# EAGLE design Maduino Zero A9G GPS Tracker v3.3 (EAGLE 6.1)
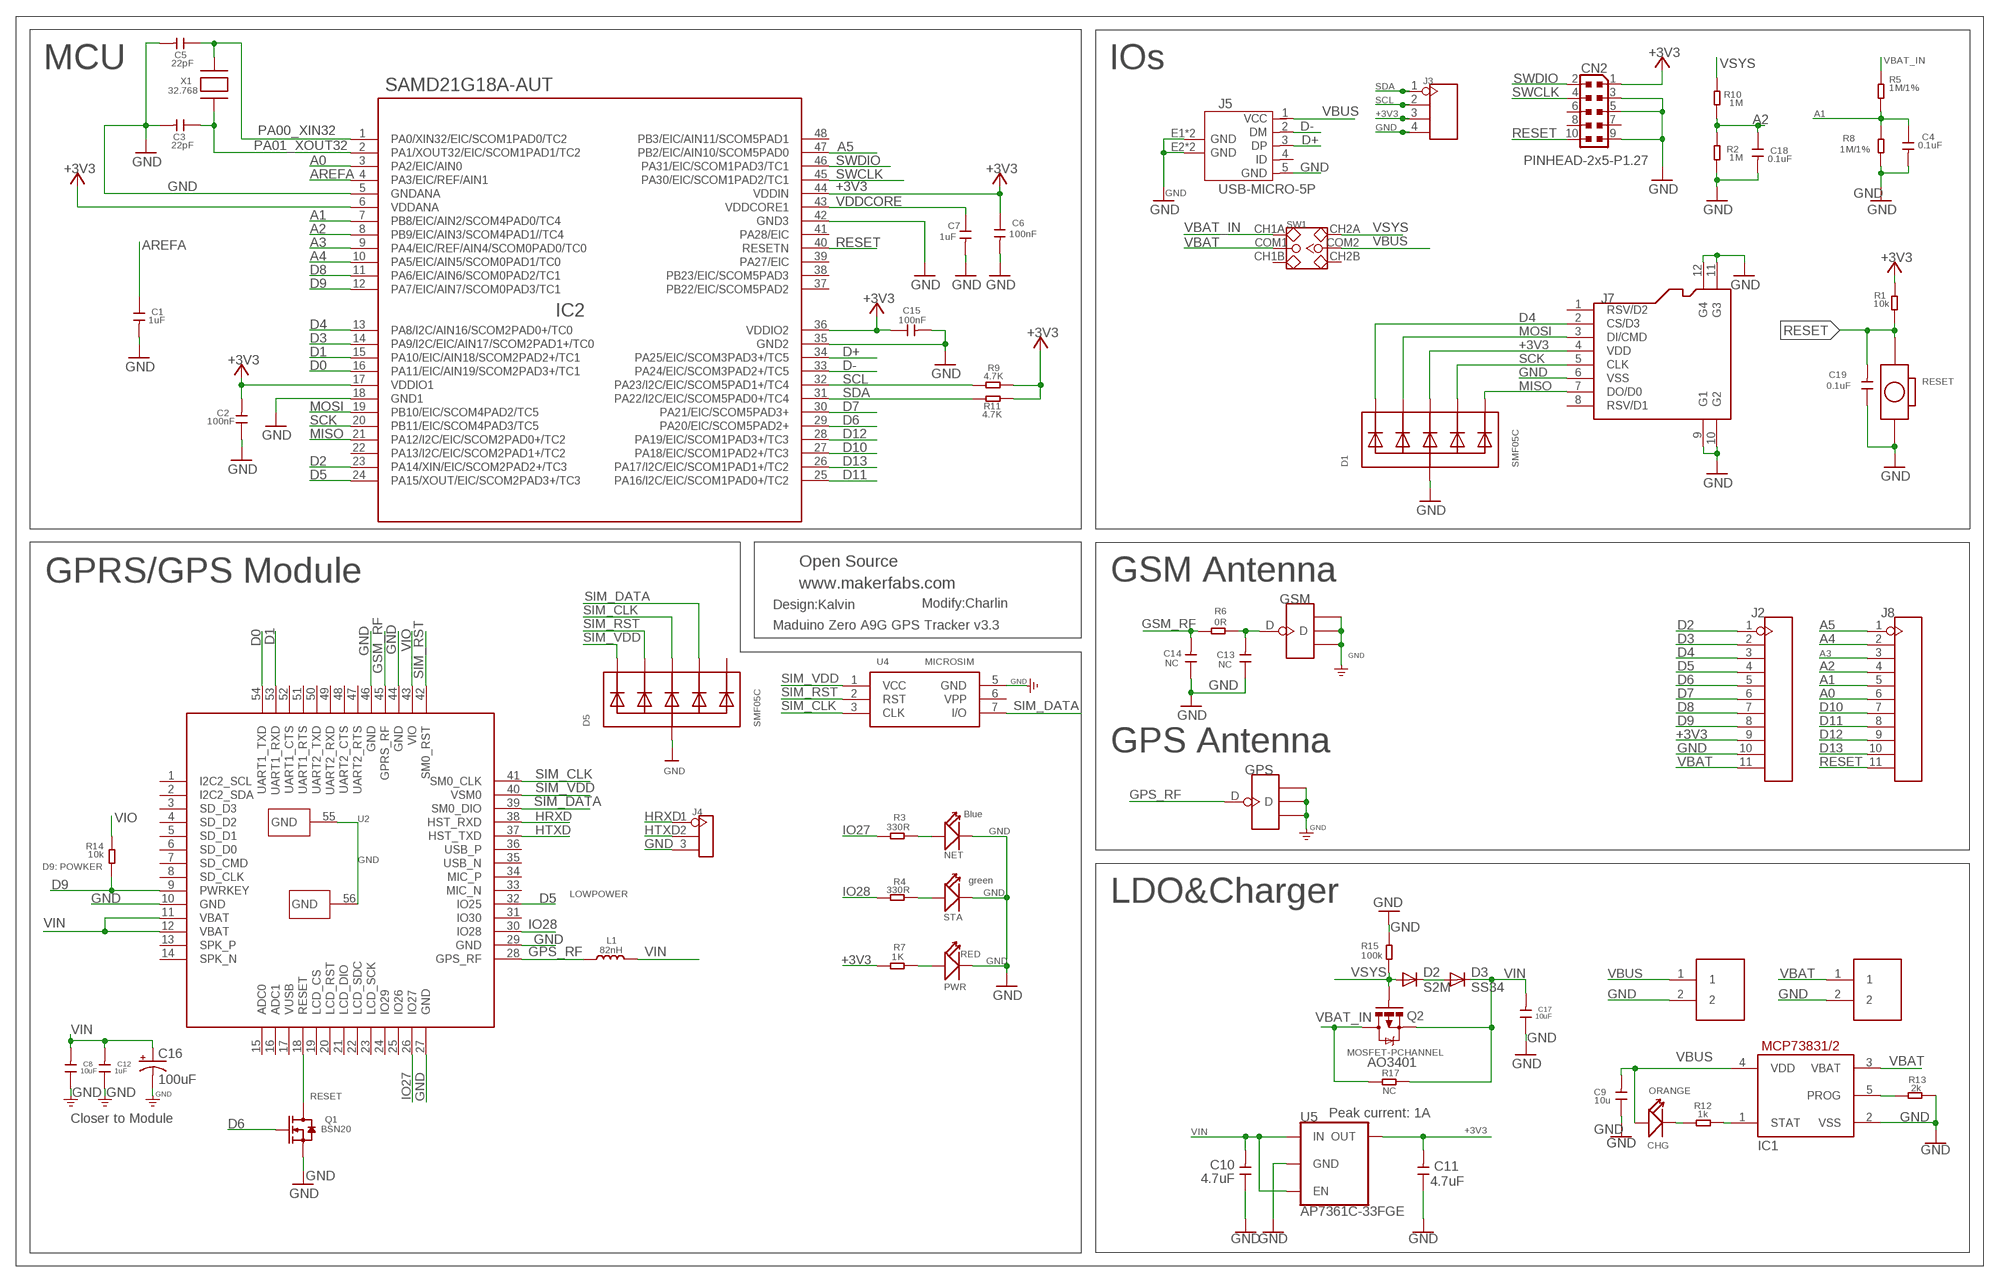
[diagram p0: schematic, sheet 1]

## Parts
C1  1uF  C-0603  [C0603]
C2  100nF  C-0603  [C0603]
C3  22pF  C-0603  [C0603]
C4  0.1uF  C-0603  [C0603]
C5  22pF  C-0603  [C0603]
C6  100nF  C-0603  [C0603]
C7  1uF  C-0603  [C0603]
C8  10uF  C-0603  [C0603]
C9  10u  C-0603  [C0603]
C10  4.7uF  C-0603  [C0603]
C11  4.7uF  C-0603  [C0603]
C12  1uF  C-0603  [C0603]
C13  NC  C-0402  [C0402]
C14  NC  C-0402  [C0402]
C15  100nF  C-0603  [C0603]
C16  100uF  68UF-POLAR-EIA3528-10V-10%(TANT)  [EIA3528]
C17  10uF  C-0603  [C0603]
C18  0.1uF  C-0603  [C0603]
C19  0.1uF  C-0603  [C0603]
CHG  ORANGE  007-LED0603  [D0603]
CN2  PINHEAD-2x5-P1.27  0171_PH127-205DF055G00AROUND-PADS  [PINHEAD_2X05_127]
D1  SMF05C  TVSARRAY_5LANE  [SOT363]
D2  S2M  DIODE-DO-214AC  [DO-214AC]
D3  SS34  DIODE-DO-214AC  [DO-214AC]
D5  SMF05C  TVSARRAY_5LANE  [SOT363]
GPS  ANTENNA-U-FL  [4P-U-FL]
GSM  ANTENNA-U-FL  [4P-U-FL]
IC1  MCP73831/OT  [SOT23-5L]
IC2  SAMD21G18A-AUT  ATSAMD21G18A-AUT  [TQFP48-7X7]
J1  PH2.0-2P-90-DIP  [PH2.0-2P-90-DIP]
J2  HEADER-11P-2.54  [11P-2.54]
J3  HEADER-4P-60/35MILROUND  [4P-65/35ROUND]
J4  HEADER-3P-2.54  [3P-2.54]
J5  USB-MICRO-5P  [MICRO-USB-5P]
J6  PH2.0-2P-90-DIP  [PH2.0-2P-90-DIP]
J7  HOLDER-MICROSD-8P  [8P-SMD]
J8  HEADER-11P-2.54  [11P-2.54]
L1  82nH  L'0603'  [L0603]
NET  Blue  LED'0603'  [LED-0603]
PWR  RED  LED'0603'  [LED-0603]
Q1  BSN20  MOSFET-N'SOT23'  [SOT23@1]
Q2  MOSFET-PCHANNEL  [SOT23-3]
R1  10k  R-0603  [R0603]
R2  1M  R-0603  [R0603]
R3  330R  R-0603  [R0603]
R4  330R  R-0603  [R0603]
R5  1M/1%  R-0603  [R0603]
R6  0R  R-0603  [R0603]
R7  1K  R-0603  [R0603]
R8  1M/1%  R-0603  [R0603]
R9  4.7K  R-0603  [R0603]
R10  1M  R-0603  [R0603]
R11  4.7K  R-0603  [R0603]
R12  1k  R-0603  [R0603]
R13  2k  R-0603  [R0603]
R14  10k  R-0603  [R0603]
R15  100k  R-0603  [R0603]
R17  NC  R-0603  [R0603]
RESET  BOTTON-2P-90D  [2P-7.62X3.56-90D]
STA  green  LED'0603'  [LED-0603]
SW1  SWITCH-2CH-6P  [6P-2CH-2.54-7.6X3.0]
U2  A9G  [A9G]
U4  MICROSIM  [MICROSIM]
U5  AP7361C-33FGE  [8-UDFN]
X1  32.768  XTAL-3.2X1.5  [XTAL3215]

## Nets
+3V3: C2.2 C6.1 C11.2 C15.1 CN2.1 D1.4(C3) IC2.6(VDDANA) IC2.17(VDDIO1) IC2.36(VDDIO2) IC2.44(VDDIN) J2.9 J3.3 J7.4(VDD) R1.2 R7.1 R9.2 R11.2 U5.1(OUT)
A0: IC2.3(PA2/EIC/AIN0) J8.6
A1: C4.1 IC2.7(PB8/EIC/AIN2/SCOM4PAD0/TC4) J8.5 R5.1 R8.2
A2: C18.1 IC2.8(PB9/EIC/AIN3/SCOM4PAD1//TC4) J8.4 R2.2 R10.1
A3: IC2.9(PA4/EIC/REF/AIN4/SCOM0PAD0/TC0) J8.3
A4: IC2.10(PA5/EIC/AIN5/SCOM0PAD1/TC0) J8.2
A5: IC2.47(PB2/EIC/AIN10/SCOM5PAD0) J8.1
AREFA: C1.1 IC2.4(PA3/EIC/REF/AIN1)
D0: IC2.16(PA11/EIC/AIN19/SCOM2PAD3+/TC1) U2.54(UART1_TXD)
D1: IC2.15(PA10/EIC/AIN18/SCOM2PAD2+/TC1) U2.53(UART1_RXD)
D2: IC2.23(PA14/XIN/EIC/SCOM2PAD2+/TC3) J2.1
D3: IC2.14(PA9/I2C/EIC/AIN17/SCOM2PAD1+/TC0) J2.2
D4: D1.1(C1) IC2.13(PA8/I2C/AIN16/SCOM2PAD0+/TC0) J2.3 J7.2(CS/D3)
D5: IC2.24(PA15/XOUT/EIC/SCOM2PAD3+/TC3) J2.4 U2.32(IO25)
D6: IC2.29(PA20/EIC/SCOM5PAD2+) J2.5 Q1.1(G)
D7: IC2.30(PA21/EIC/SCOM5PAD3+) J2.6
D8: IC2.11(PA6/EIC/AIN6/SCOM0PAD2/TC1) J2.7
D9: IC2.12(PA7/EIC/AIN7/SCOM0PAD3/TC1) J2.8 R14.1 U2.9(PWRKEY)
D10: IC2.27(PA18/EIC/SCOM1PAD2+/TC3) J8.7
D11: IC2.25(PA16/I2C/EIC/SCOM1PAD0+/TC2) J8.8
D12: IC2.28(PA19/EIC/SCOM1PAD3+/TC3) J8.9
D13: IC2.26(PA17/I2C/EIC/SCOM1PAD1+/TC2) J8.10
D+: IC2.34(PA25/EIC/SCOM3PAD3+/TC5) J5.3(DP)
D-: IC2.33(PA24/EIC/SCOM3PAD2+/TC5) J5.2(DM)
GND: C1.2 C2.1 C3.2 C4.2 C5.2 C6.2 C7.2 C8.1 C9.1 C10.1 C11.1 C12.1 C13.1 C14.1 C15.2 C16.C(-) C17.1 C18.2 C19.1 CN2.3 CN2.5 CN2.9 D1.2(A) D5.2(A) GPS.GND1 GPS.GND2 GPS.GND3 GSM.GND1 GSM.GND2 GSM.GND3 IC1.2(VSS) IC2.5(GNDANA) IC2.18(GND1) IC2.35(GND2) IC2.42(GND3) J1.2 J2.10 J3.4 J4.3 J5.5(GND) J5.E1(GND) J5.E2(GND) J5.P1(GND) J5.P2(GND) J6.2 J7.6(VSS) J7.9(G1) J7.10(G2) J7.11(G3) J7.12(G4) NET.- PWR.- Q1.2(S) R2.1 R8.1 R13.2 R15.2 RESET.P$2 STA.- U2.10(GND) U2.27(GND) U2.29(GND) U2.44(GND) U2.46(GND) U2.55(GND) U2.56(GND) U4.5(GND) U5.4(GND) U5.EP(GND)
GPS_RF: GPS.D L1.1 U2.28(GPS_RF)
GSM_RF: C14.2 R6.1 U2.45(GPRS_RF)
HRXD: J4.1 U2.38(HST_RXD)
HTXD: J4.2 U2.37(HST_TXD)
IO27: R3.1 U2.26(IO27)
IO28: R4.1 U2.30(IO28)
MISO: D1.6(C5) IC2.21(PA12/I2C/EIC/SCOM2PAD0+/TC2) J7.7(DO/D0)
MOSI: D1.3(C2) IC2.19(PB10/EIC/SCOM4PAD2/TC5) J7.3(DI/CMD)
N$1: R4.2 STA.+
N$2: D2.C D3.A
N$3: PWR.+ R7.2
N$7: NET.+ R3.2
N$8: Q1.3(D) U2.18(RESET)
N$25: CHG.- R12.1
N$26: IC1.1(STAT) R12.2
N$31: IC1.5(PROG) R13.1
N$94: C13.2 GSM.D R6.2
PA00_XIN32: C5.1 IC2.1(PA0/XIN32/EIC/SCOM1PAD0/TC2) X1.P$2
PA01_XOUT32: C3.1 IC2.2(PA1/XOUT32/EIC/SCOM1PAD1/TC2) X1.P$1
RESET: C19.2 CN2.10 IC2.40(RESETN) J8.11 R1.1 RESET.P$1
SCK: D1.5(C4) IC2.20(PB11/EIC/SCOM4PAD3/TC5) J7.5(CLK)
SCL: IC2.32(PA23/I2C/EIC/SCOM5PAD1+/TC4) J3.2 R9.1
SDA: IC2.31(PA22/I2C/EIC/SCOM5PAD0+/TC4) J3.1 R11.1
SIM_CLK: D5.4(C3) U2.41(SM0_CLK) U4.3(CLK)
SIM_DATA: D5.5(C4) U2.39(SM0_DIO) U4.7(I/O)
SIM_RST: D5.3(C2) U2.42(SM0_RST) U4.2(RST)
SIM_VDD: D5.1(C1) U2.40(VSM0) U4.1(VCC)
SWCLK: CN2.4 IC2.45(PA30/EIC/SCOM1PAD2/TC1)
SWDIO: CN2.2 IC2.46(PA31/EIC/SCOM1PAD3/TC1)
VBAT: IC1.3(VBAT) J2.11 J6.1 SW1.COM1
VBAT_IN: Q2.3(D) R5.2 R17.1 SW1.CH1A
VBUS: C9.2 CHG.+ IC1.4(VDD) J1.1 J5.1(VCC) SW1.COM2
VDDCORE: C7.1 IC2.43(VDDCORE1)
VIN: C8.2 C10.2 C12.2 C16.A(+) C17.2 D3.C L1.2 Q2.2(S) R17.2 U2.11(VBAT) U2.12(VBAT) U5.5(EN) U5.8(IN)
VIO: R14.2 U2.43(VIO)
VSYS: D2.A Q2.1(G) R10.2 R15.1 SW1.CH2A
Unconnected: CN2.6 CN2.7 CN2.8 D5.6(C5) IC2.22(PA13/I2C/EIC/SCOM2PAD1+/TC2) IC2.37(PB22/EIC/SCOM5PAD2) IC2.38(PB23/EIC/SCOM5PAD3) IC2.39(PA27/EIC) IC2.41(PA28/EIC) IC2.48(PB3/EIC/AIN11/SCOM5PAD1) J5.4(ID) J7.1(RSV/D2) J7.8(RSV/D1) SW1.CH1B SW1.CH2B U2.1(I2C2_SCL) U2.2(I2C2_SDA) U2.3(SD_D3) U2.4(SD_D2) U2.5(SD_D1) U2.6(SD_D0) U2.7(SD_CMD) U2.8(SD_CLK) U2.13(SPK_P) U2.14(SPK_N) U2.15(ADC0) U2.16(ADC1) U2.17(VUSB) U2.19(LCD_CS) U2.20(LCD_RST) U2.21(LCD_DIO) U2.22(LCD_SDC) U2.23(LCD_SCK) U2.24(IO29) U2.25(IO26) U2.31(IO30) U2.33(MIC_N) U2.34(MIC_P) U2.35(USB_N) U2.36(USB_P) U2.47(UART2_RTS) U2.48(UART2_CTS) U2.49(UART2_RXD) U2.50(UART2_TXD) U2.51(UART1_RTS) U2.52(UART1_CTS) U4.6(VPP)

## Notes on the sheet
- MCU | IOs
- Open Source
- GPRS/GPS Module | GSM Antenna
- www.makerfabs.com
- Design:Kalvin | Modify:Charlin
- Maduino Zero A9G GPS Tracker v3.3
- GPS Antenna
- D9: POWKER
- LOWPOWER
- LDO&Charger
- AO3401
- RESET
- Peak current: 1A
- Closer to Module

## Library data of the parts
C1-C15 C17-C19 = Discrete:C*: Ceramic Capacitors
C16 = SparkFun-Capacitors:68UF-POLAR: 68µF polarized capacitors A capacitor is a passive two-terminal electrical component used to store electrical energy temporarily in an electric field.; PROD_ID: CAP-10790; VALUE: 68uF
CHG = Discrete:007-LED*
CN2 = Connettori:0171_PH127-205DF055G00A: 2x5 PASSO 1,27
D1 D5 = microbuilder:TVSARRAY_5LANE: Voltage Transient Suppressor Array SOT363 SMF05C - 100W 5V: Digikey - SMF05CT1GOSCT-ND
D2 D3 = diode:DIODE-: DIODE
GPS GSM = Connector:ANTENNA-U-FL
IC1 = adafruit:MCP73831: MCP73831/2 Miniature Single-Cell, Fully Integrated Li-Ion, Li-Polymer Charge Management Controllers. Nice and small simple lipoly charge controller, with adjustable current and status output (LED) http://www.ladyada.net/library/pcb/eaglelibrary.html
IC2 = IC:ATSAMD21G18A-AUT: Atmel D21 32bit ARM Cortex-M0 microcontroller - 48 PIN TQFP 256KB flash memory + 32KB SRAM
J1 J6 = Connector:PH2.0-2P-90-DIP
J2 J8 = Connector:HEADER-11P
J3 = Connector:HEADER-4P
J4 = Connector:HEADER-3P
J5 = Connector:USB-MICRO-5P
J7 = Connector:HOLDER-MICROSD-8P
L1 = Discrete:L*
NET PWR STA = Discrete:LED*
Q1 = Discrete:MOSFET-N: IRLL014: http://www.vishay.com/docs/91319/sihll014.pdf
Q2 = User-Submitted:MOSFET-PCHANNEL: Generic PMOSFET IRLML2244 - TRANS-11153 (SOT-23 -20V -4.3A) (1.Gate 2.Source 3.Drain) FQP27P06 - COM-10349 <http://www.sparkfun.com/products/10349> (TO-220 -60V -27A) (1.Gate 2.Source 3.Drain); PROD_ID: TRANS-08285
R1-R15 R17 = Discrete:R*
RESET = Discrete:BOTTON-2P
SW1 = Discrete:SWITCH-2CH-6P
U2 = A9G:A9G
U4 = Connector:MICROSIM
U5 = ublox:AP7361C-33FGE: AP7361C 3.3V LDO Regulator; PROD_ID: VREG-14094
X1 = adafruit2:XTAL: Low cost SMT crystals, no capacitors included http://www.ladyada.net/library/eagle

## Net classes
0 default: width 0.203 mm, drill 0.305 mm, clearance 0.152 mm
2 gnd: width 0.305 mm, drill 0.559 mm, clearance 0.254 mm
3 usbvcc: width 0.508 mm, drill 0.61 mm, clearance 0.254 mm
4 USBpair: width 0.254 mm, drill 0.406 mm, clearance 0.406 mm

## Board
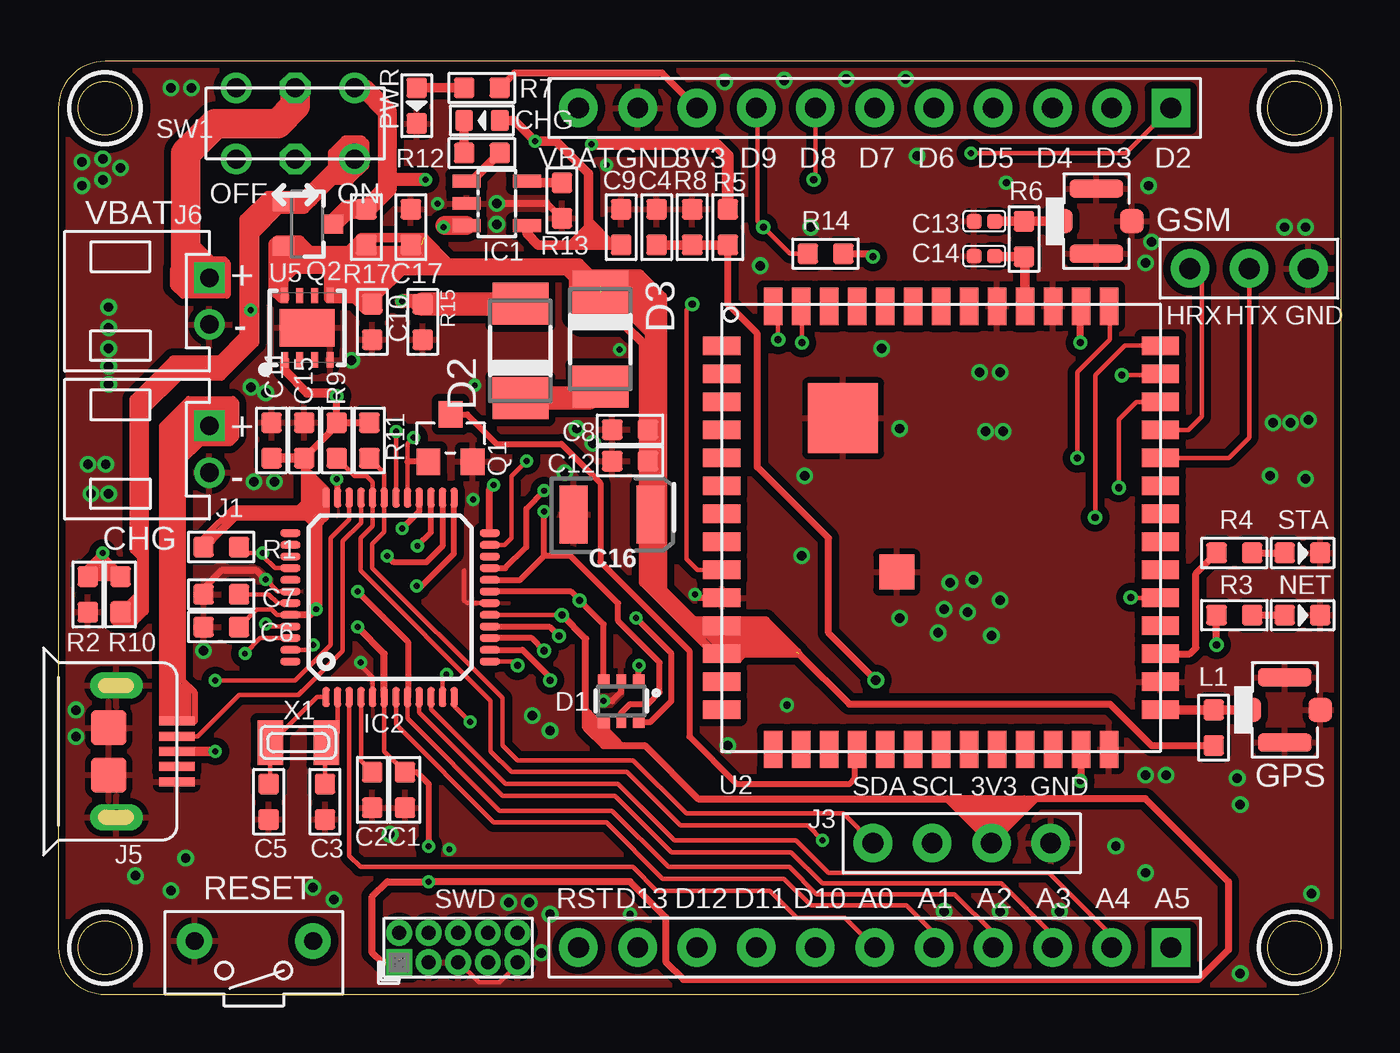
[diagram p1: board, top side]
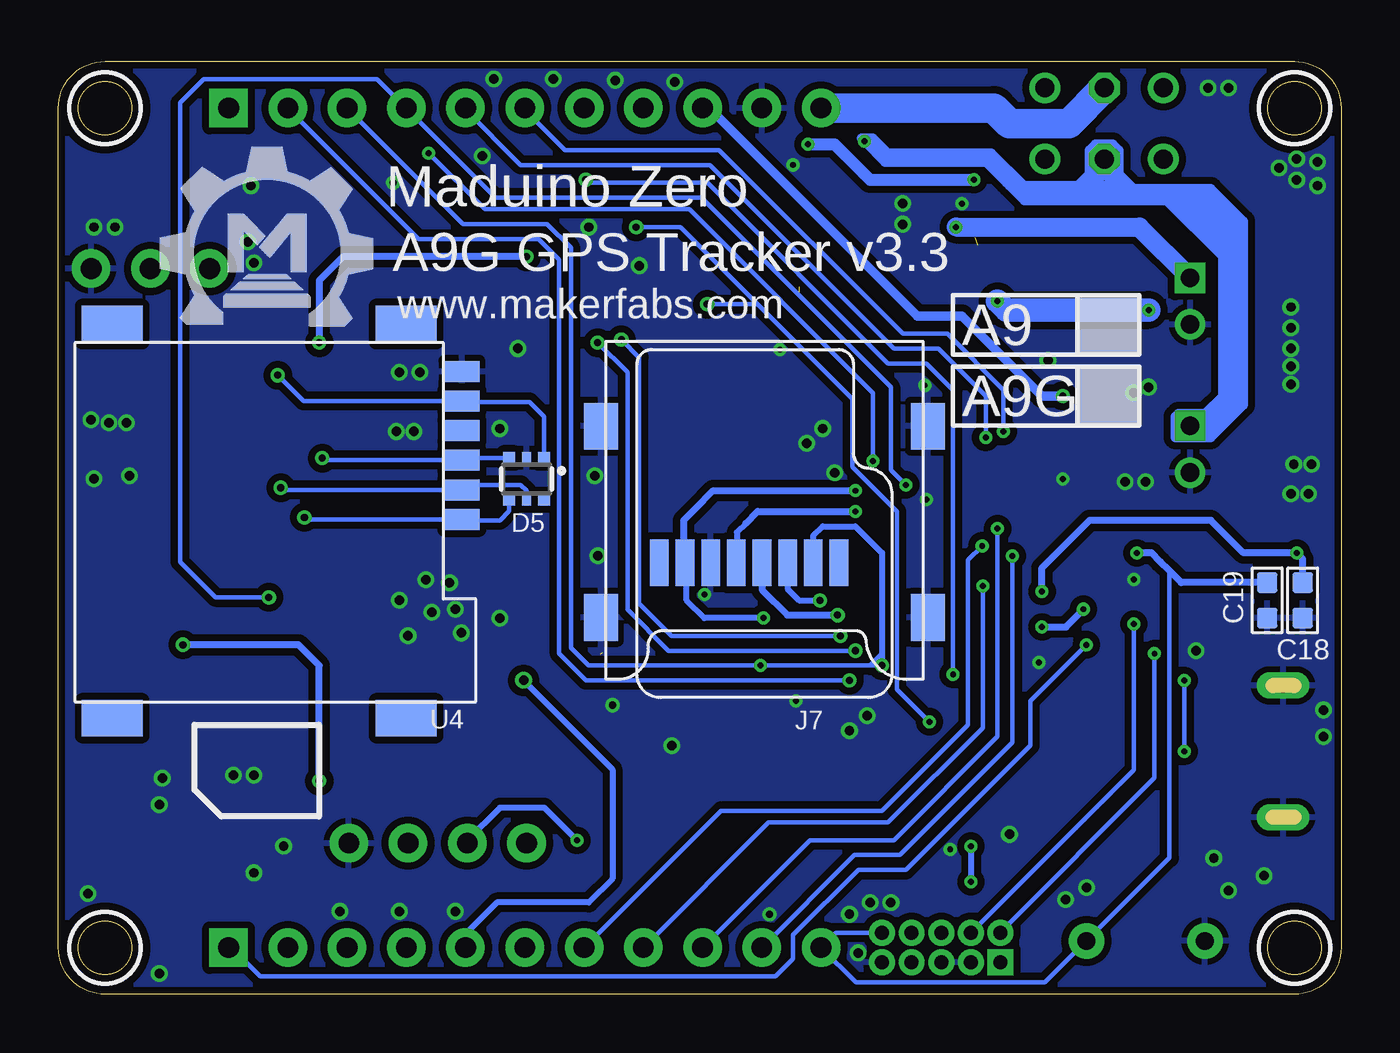
[diagram p2: board, bottom side, seen from below]

Size 55 x 40 mm. Coordinates in mm from the lower left corner, seen from the top.
Outline: 0,38 0,2 arc90 2,0 53,0 arc90 55,2 55,38 arc90 53,40 2,40 arc90 0,38
Outline: circle at 53,2 radius 1.14
Outline: circle at 53,38 radius 1.14
Outline: circle at 2,2 radius 1.14
Outline: circle at 2,38 radius 1.14
Copper layers (1*16): Top 0.035mm / dielectric 1.5mm / Bottom 0.035mm
Design rules: minimum track width 6mil, minimum drill 10mil, track to track 6mil, track to pad 6mil, pad to pad 6mil, via to via 6mil, smd to smd 0mil, copper to edge 10mil, drill to drill 10mil, minimum pad ring 10mil, minimum via ring 6mil, stop-mask expansion 2mil, vias tented up to drill 100mil, thermal gap 10mil
tRestrict: area 51.5,0.5 to 54.5,3.5; area 51.5,36.5 to 54.5,39.5; area 0.5,0.5 to 3.5,3.5; area 0.5,36.5 to 3.5,39.5
bRestrict: area 51.5,0.5 to 54.5,3.5; area 51.5,36.5 to 54.5,39.5; area 0.5,0.5 to 3.5,3.5; area 0.5,36.5 to 3.5,39.5

### Footprints (pad centres in the part's own frame; a part is rotated, then mirrored left to right if it is on the bottom)
C0603 = smd 0.889 x 0.889: 1 -0.762,0; 2 0.762,0
C0402 = smd 0.635 x 0.635: 1 -0.445,0; 2 0.445,0
EIA3528 = smd 1.2 x 2.5: A 1.65,0; C -1.65,0
D0603 = smd 0.762 x 0.889: + -0.762,0; - 0.762,0
PINHEAD_2X05_127 = drill 0.6 pad 1.016 square: 1 -0.635,2.54 | drill 0.6 pad 1.016: 2 0.635,2.54; 3 -0.635,1.27; 4 0.635,1.27; 5 -0.635,0; 6 0.635,0; 7 -0.635,-1.27; 8 0.635,-1.27; 9 -0.635,-2.54; 10 0.635,-2.54
SOT363 = smd 0.5 x 0.5: 1 -0.75,-0.9; 3 0.75,-0.9; 4 0.75,0.9; 6 -0.75,0.9 | smd 0.4 x 0.5: 2 0,-0.9; 5 0,0.9
DO-214AC = smd 1.8 x 2.4: A 2.025,0; C -2.025,0
4P-U-FL = smd 1.016 x 1.016: D -1.524,0; GND3 1.524,0 | smd 2.286 x 0.762: GND1 0,1.397; GND2 0,-1.397
SOT23-5L = smd 0.55 x 1.2: 1 -0.95,-1.3; 2 0,-1.3; 3 0.95,-1.3; 4 0.95,1.3; 5 -0.95,1.3
TQFP48-7X7 = smd 0.85 x 0.32: 1 -4.275,2.75; 2 -4.275,2.25; 3 -4.275,1.75; 4 -4.275,1.25; 5 -4.275,0.75; 6 -4.275,0.25; 7 -4.275,-0.25; 8 -4.275,-0.75; 9 -4.275,-1.25; 10 -4.275,-1.75; 11 -4.275,-2.25; 12 -4.275,-2.75; 25 4.275,-2.75; 26 4.275,-2.25; 27 4.275,-1.75; 28 4.275,-1.25; 29 4.275,-0.75; 30 4.275,-0.25; 31 4.275,0.25; 32 4.275,0.75; 33 4.275,1.25; 34 4.275,1.75; 35 4.275,2.25; 36 4.275,2.75 | smd 0.32 x 0.85: 13 -2.75,-4.275; 14 -2.25,-4.275; 15 -1.75,-4.275; 16 -1.25,-4.275; 17 -0.75,-4.275; 18 -0.25,-4.275; 19 0.25,-4.275; 20 0.75,-4.275; 21 1.25,-4.275; 22 1.75,-4.275; 23 2.25,-4.275; 24 2.75,-4.275; 37 2.75,4.275; 38 2.25,4.275; 39 1.75,4.275; 40 1.25,4.275; 41 0.75,4.275; 42 0.25,4.275; 43 -0.25,4.275; 44 -0.75,4.275; 45 -1.25,4.275; 46 -1.75,4.275; 47 -2.25,4.275; 48 -2.75,4.275
PH2.0-2P-90-DIP = drill 0.8 square: 1 0,1 | drill 0.8: 2 0,-1
11P-2.54 = drill 0.889 pad 1.651 square: 1 0,12.7 | drill 0.889 pad 1.651: 2 0,10.16; 3 0,7.62; 4 0,5.08; 5 0,2.54; 6 0,0; 7 0,-2.54; 8 0,-5.08; 9 0,-7.62; 10 0,-10.16; 11 0,-12.7
4P-65/35ROUND = drill 0.889 pad 1.651: 1 0,3.81; 2 0,1.27; 3 0,-1.27; 4 0,-3.81
3P-2.54 = drill 0.9 pad 1.651: 1 0,2.54; 2 0,0; 3 0,-2.54
MICRO-USB-5P = smd 0.38 x 1.52: 1 -1.3,0; 2 -0.65,0; 3 0,0; 4 0.65,0; 5 1.3,0 | smd 1.524 x 1.524: E1 -1.016,-2.921; E2 1.016,-2.921 | drill 0.635 pad 1.143 long: P1 -2.819,-2.591; P2 2.819,-2.591
8P-SMD = smd 0.8 x 2.008: 1 -3.198,0.254; 2 -2.098,0.254; 3 -0.998,0.254; 4 0.102,0.254; 5 1.202,0.254; 6 2.302,0.254; 7 3.402,0.254; 8 4.502,0.254 | smd 1.45 x 2: 9 -7.002,2.6; 10 7.002,2.6; 11 -7.002,-5.598; 12 7.002,-5.598
L0603 = smd 0.889 x 0.889: 1 -0.762,0; 2 0.762,0
LED-0603 = smd 0.889 x 0.889: + -0.762,0; - 0.762,0
SOT23@1 = smd 1.016 x 1.143: 1 -0.95,-1.016; 2 0.95,-1.016; 3 0,1.016
SOT23-3 = smd 0.8 x 0.9: 1 -0.95,-1; 2 0.95,-1; 3 0,1.1
R0603 = smd 0.889 x 0.889: 1 -0.762,0; 2 0.762,0
2P-7.62X3.56-90D = drill 0.762 pad 1.524: P$1 0,2.54; P$2 0,-2.54
6P-2CH-2.54-7.6X3.0 = drill 0.813 pad 1.27: CH1A -1.524,2.54; CH1B -1.524,-2.54; CH2A 1.524,2.54; CH2B 1.524,-2.54 | drill 0.813 pad 1.27 octagon: COM1 -1.524,0; COM2 1.524,0
A9G = smd 1.6 x 0.8: 1 -9.4,7.8; 2 -9.4,6.6; 3 -9.4,5.4; 4 -9.4,4.2; 5 -9.4,3; 6 -9.4,1.8; 7 -9.4,0.6; 8 -9.4,-0.6; 9 -9.4,-1.8; 10 -9.4,-3; 11 -9.4,-4.2; 12 -9.4,-5.4; 13 -9.4,-6.6; 14 -9.4,-7.8; 28 9.4,-7.8; 29 9.4,-6.6; 30 9.4,-5.4; 31 9.4,-4.2; 32 9.4,-3; 33 9.4,-1.8; 34 9.4,-0.6; 35 9.4,0.6; 36 9.4,1.8; 37 9.4,3; 38 9.4,4.2; 39 9.4,5.4; 40 9.4,6.6; 41 9.4,7.8 | smd 0.8 x 1.6: 15 -7.2,-9.5; 16 -6,-9.5; 17 -4.8,-9.5; 18 -3.6,-9.5; 19 -2.4,-9.5; 20 -1.2,-9.5; 21 0,-9.5; 22 1.2,-9.5; 23 2.4,-9.5; 24 3.6,-9.5; 25 4.8,-9.5; 26 6,-9.5; 27 7.2,-9.5; 42 7.2,9.5; 43 6,9.5; 44 4.8,9.5; 45 3.6,9.5; 46 2.4,9.5; 47 1.2,9.5; 48 0,9.5; 49 -1.2,9.5; 50 -2.4,9.5; 51 -3.6,9.5; 52 -4.8,9.5; 53 -6,9.5; 54 -7.2,9.5 | smd 3 x 3: 55 -4.2,4.7 | smd 1.5 x 1.5: 56 -1.9,-1.9
MICROSIM = smd 1.5 x 0.9: 1 -0.8,2.5; 2 -0.8,5.04; 3 -0.8,7.58; 5 -0.8,1.23; 6 -0.8,3.77; 7 -0.8,6.31 | smd 2.61 x 1.56: P$1 1.6,-0.8; P$2 14.2,-0.8; P$3 14.2,16.1; P$4 1.6,16.1
8-UDFN = smd 0.3 x 0.65: 1 -0.975,-1.375; 2 -0.325,-1.375; 3 0.325,-1.375; 4 0.975,-1.375; 5 0.975,1.375; 6 0.325,1.375; 7 -0.325,1.375; 8 -0.975,1.375 | smd 2.35 x 1.6: EP 0,0
XTAL3215 = smd 1.1 x 1.9: P$1 1.2,0; P$2 -1.2,0

### Placement (x,y rotation side)
C1  13.46,8.76 270 top
C2  14.86,8.76 90 top
C3  11.43,8.26 270 top
C4  25.65,32.89 90 top
C5  9.02,8.26 270 top
C6  6.99,15.75 180 top
C7  6.99,17.14 180 top
C8  24.51,24.21 0 top
C9  24.13,32.89 270 top
C10  13.46,28.83 90 top
C11  9.14,23.75 270 top
C12  24.51,22.86 0 top
C13  39.7,33.15 0 top
C14  39.7,31.65 0 top
C15  10.54,23.75 90 top
C16  23.75,20.57 0 top
C17  15.11,32.89 270 top
C18  1.65,16.89 270 bottom
C19  3.17,16.89 90 bottom
CHG  18.16,37.47 180 top
CN2  17.14,2 90 top
D1  24.13,12.57 180 top
D2  19.81,27.58 90 top
D3  23.24,28.09 270 top
D5  34.92,22.1 180 bottom
GPS  52.58,12.19 0 top
GSM  44.5,33.15 0 top
IC1  18.8,33.91 270 top
IC2  14.22,17.02 90 top
J1  6.48,23.37 0 top
J2  35,38 270 top
J3  38.73,6.48 90 top
J4  51.05,31.11 90 top
J5  5.08,10.41 270 top
J6  6.48,29.72 0 top
J7  24.73,18.76 180 bottom
J8  35,2 270 top
L1  49.53,11.43 270 top
NET  53.34,16.26 0 top
PWR  15.37,38.1 270 top
Q1  16.81,23.85 0 top
Q2  10.67,33.02 270 top
R1  6.99,19.18 180 top
R2  1.27,17.14 90 top
R3  50.42,16.26 0 top
R4  50.42,18.92 0 top
R5  28.7,32.89 90 top
R6  41.4,32.38 90 top
R7  18.16,38.86 180 top
R8  27.18,32.89 270 top
R9  11.94,23.75 90 top
R10  2.67,17.14 270 top
R11  13.34,23.75 90 top
R12  18.16,36.07 0 top
R13  21.59,34.04 270 top
R14  32.89,31.75 0 top
R15  15.62,28.83 270 top
R17  13.21,32.89 270 top
RESET  8.38,2.29 270 top
STA  53.34,18.92 0 top
SW1  10.16,37.34 270 top
U2  37.85,20 0 top
U4  38.49,27.94 180 bottom
U5  10.67,28.57 0 top
U$1  [MAKERFABS_0.3]  50.17,28.7 0 bottom
X1  10.29,10.79 0 top

### Tracks (layer width: path | path; a pad name or v marks a point on that pad's centre or on a via)
+3V3  (via drill 0.25, 0.3)
  Top 0.203: IC2.6 13.97,10.41 C2.2 | IC2.44 9.39,16.27 9.14,16.51 8.51,16.51 C6.1 | v21.59,16.26 18.51,16.26 IC2.17
  Top 0.254: C15.1 10.54,23.11 | v15.88,6.35 15.88,9.02 15.37,9.53 C2.2 | 11.43,21.72 11.43,21.08 10.92,20.57 11.18,20.57 11.43,20.83 11.43,20.57 | 11.43,21.72 10.67,22.48 10.67,21.21 10.29,20.83 7.49,20.83 6.35,19.68 6.6,19.43 7.62,20.45 10.79,20.45 | 11.43,20.57 11.35,20.5 11.2,20.5 10.72,20.98 10.72,22.05 10.82,22.15 10.82,22.07 11.3,21.59 11.3,21.26 10.97,20.93 10.97,21.72 10.87,21.82 10.9,21.82 11.12,21.59 11.12,21.31 | 11.51,21.31 11.51,20.65 11.43,20.57 | 11.43,21.72 11.51,21.64 11.51,20.68 11.35,20.52 | 6.66,19.89 6.55,19.89 6.12,19.46 6.12,19.28 R1.2 | 22.76,12.06 23.9,10.92 | 24.16,10.67 23.9,10.92 | 23.9,10.92 23.62,10.92
  Top 0.305: CN2.1 13.88,1.36 13.46,1.78 13.46,4.19 14.1,4.83 v15.88,4.83 24.51,4.83 26.04,3.3 26.04,1.4 26.8,0.64 48.9,0.64 50.16,1.91 50.16,4.83 46.61,8.38 41.91,8.38 | R9.2 v11.94,25.65 | R9.2 R11.2 13.46,24.51 | R9.2 11.94,24.38 C15.1 10.54,20.83 10.67,20.7 | J2.9 25.88,39.5 19.56,39.5 R7.1 | 22.67,11.37 22.61,11.43 22.61,12.19 | 22.67,11.37 23.37,10.67 24.16,10.67 25.15,10.67 27.43,8.38 38.1,8.38 | 22.61,12.19 22.61,15.24 v21.59,16.26 | IC2.6 13.97,14.6 v12.83,15.75 | v11.05,16.51 10.79,16.26 9.91,16.26 9.92,16.27 IC2.44 | IC2.36 11.47,21.13 11.43,21.08 11.05,20.7 | 11.05,20.7 11.05,20.19 | 10.67,20.7 11.05,20.7 | R1.2 7.75,20.7 10.67,20.7 | 22.67,11.37 22.73,11.43 23.14,11.43 D1.4 | 38.1,8.38 38.35,8.38 | 40.01,8.38 41.4,8.38 | 41.4,8.38 41.91,8.38 | J3.3 40.01,8.38 | 40.01,8.38 38.35,8.38 | 38.35,8.38 38.35,8.13 | 38.35,8.13 J3.3 | J3.3 41.4,7.87 | 41.4,7.87 41.4,8.26 | 41.4,8.38 41.4,8.26 | 41.4,8.26 40.13,6.99 40.01,6.99 39.88,6.86 39.88,6.99 38.61,8.26 41.02,8.26 41.15,8.13 40.89,8.13 40.13,7.37 39.75,7.37 39.75,7.49 39.12,8.13 40.51,8.13 40.64,8 40.51,8 40.39,7.87 | 40.39,7.87 40.13,7.62 39.88,7.62 39.5,8 40.26,8 40.39,7.87 | 41.91,8.38 41.4,7.87 | 38.1,8.38 38.35,8.13 | 22.61,12.19 22.99,11.81 23.5,11.81 23.5,10.79 22.73,11.56 22.73,11.81 23.11,11.43 | 23.37,11.18 23.11,11.43 | 23.11,11.43 23.11,11.68
  Top 0.406: C11.2 C15.1 | U5.1 9.69,26.76 10.67,25.78 11.81,25.78 v11.94,25.65
  Top 0.508: 11.05,20.19 v11.05,16.51 | 10.79,20.45 11.05,20.19 | 11.05,20.19 11.35,20.5
  Bottom 0.254: 24.89,18.44 J7.4 | v15.88,6.35 v15.88,4.83
  Bottom 0.305: J7.4 24.83,17.34 23.75,16.26 v21.59,16.26 | v12.83,15.75 11.8,15.75 v11.05,16.5 v11.05,16.51
  Bottom 0.406: J2.9 27.08,38 18.16,29.08 16.26,29.08 12.83,25.65 v11.94,25.65
A0
  Top 0.203: IC2.3 12.47,5.94 12.95,5.46 24.64,5.46 25.65,4.45 30.5,4.45 31.67,3.28 33.72,3.28 J8.6
A1  (via drill 0.41)
  Top 0.203: IC2.7 14.47,11.56 18.67,7.37 23.5,7.37 25.91,4.95 31.11,4.95 32.26,3.81 36.24,3.81 36.37,3.81 37.54,2.63 J8.5
  Top 0.305: v35.05,13.46 33.02,15.49 33.02,19.56 29.97,22.61 29.97,28.32 28.7,29.59 R5.1
  Top 0.406: C4.1 R8.2 R5.1
  Bottom 0.254: v35.05,13.46 31.24,9.65 31.24,4.95 32.26,3.94 36.2,3.94 37.54,2.59 J8.5
A2  (via drill 0.25)
  Top 0.203: IC2.8 14.97,11.82 18.92,7.87 23.75,7.87 26.16,5.46 31.34,5.46 32.51,4.29 38.42,4.29 40.08,2.63 J8.4
  Top 0.254: 14.99,12.76 14.99,15.11 v12.83,17.27
  Top 0.305: 1.91,17.91 1.91,18.41 | 14.99,12.76 IC2.8 | 1.91,18.8 1.91,18.67 | 1.91,18.67 1.91,18.41 | 1.91,18.41 2.29,18.03 1.91,18.03 1.78,18.16 1.4,18.16 | 1.52,18.29 1.91,18.67 | 1.91,18.8 v1.91,18.92 1.27,18.29 1.27,18.16 | 1.91,18.8 2.41,18.29 1.52,18.29 | 1.52,18.29 1.4,18.16 | 1.4,18.16 1.27,18.16 | 1.27,18.16 1.91,18.8
  Top 0.406: R2.2 1.91,17.91 R10.1
  Bottom 0.305: C18.1 1.65,18.67 v1.91,18.92 4.19,18.92 5.59,20.32 10.79,20.32 12.83,18.29 v12.83,17.27
A3
  Top 0.203: IC2.9 15.47,12.09 19.05,8.51 23.88,8.51 26.29,6.1 31.42,6.1 32.77,4.75 40.43,4.75 42.62,2.56 J8.3
A4
  Top 0.203: IC2.10 15.97,12.22 19.18,9.02 24,9.02 26.42,6.6 31.62,6.6 33.02,5.21 42.46,5.21 45.16,2.51 J8.2
A5  (via drill 0.25)
  Top 0.203: IC2.47 10.7,14.77 v10.92,14.99
  Bottom 0.203: J8.1 47.59,2 46.35,0.76 24.26,0.76 23.5,1.52 23.5,2.54 20.7,5.33 18.67,5.33 13.34,10.67 13.34,12.57 v10.92,14.99
AREFA
  Top 0.203: IC2.4 12.97,10.01 C1.1
D0  (via drill 0.3)
  Top 0.203: 30.73,29.41 U2.54 30.86,29.29 v30.86,28.07
  Top 0.254: v21.46,15.37 21.08,15.75 18.48,15.75 | 18.41,15.75 18.48,15.75 | 18.48,15.75 IC2.16
  Bottom 0.203: v21.46,15.37 28.7,15.37 30.1,16.76 30.1,27.3 v30.86,28.07
D1  (via drill 0.3)
  Top 0.203: v31.88,27.94 31.88,29.47 U2.53
  Top 0.254: v20.83,14.73 20.29,15.27 IC2.15
  Bottom 0.203: v31.88,27.94 30.61,26.67 30.61,16.51 28.83,14.73 v20.83,14.73
D2  (via drill 0.25)
  Top 0.203: IC2.23 19.14,19.27 19.43,19.56 19.43,22.23 v20.07,22.86 | v39.12,36.07 45.77,36.07 J2.1
  Bottom 0.203: v39.12,36.07 36.7,33.66 27.94,33.66 20.07,25.78 v20.07,22.86
D3  (via drill 0.3)
  Top 0.254: v21.08,13.46 21.08,13.59 19.9,14.77 IC2.14
  Bottom 0.203: v21.08,13.46 32.38,13.46 33.53,14.61 33.53,31.5 34.42,32.38 39.55,32.38 J2.2
D4  (via drill 0.25, 0.3)
  Top 0.203: IC2.13 19.51,14.27 v19.68,14.1
  Top 0.254: D1.1 v24.88,14.11 v24.89,14.1
  Bottom 0.203: v19.68,14.1 20.19,14.1 | 20.19,14.1 v24.89,14.1 32.26,14.1 33.02,14.86 33.02,32 34.04,33.02 37.64,33.02 J2.3 | 20.19,14.1 19.94,14.35 | 19.68,14.61 19.94,14.35 | 19.94,14.35 19.94,14.22 19.81,14.22
  Bottom 0.254: J7.2 22.63,19.66 22.23,20.07 20.83,20.07 19.68,18.92 19.68,14.61 v19.68,14.1
D5  (via drill 0.25, 0.3)
  Top 0.203: U2.32 45.99,17 v45.97,17.02
  Top 0.305: IC2.24 18.5,21.67 v18.67,21.84
  Bottom 0.203: v45.97,17.02 48.26,17.02 49.78,18.54 49.78,38.23 48.77,39.24 41.32,39.24 J2.4 36.24,34.16 27.43,34.16 19.3,26.04 19.3,22.48 v18.67,21.84
D6  (via drill 0.25)
  Top 0.203: IC2.29 14.97,22.84 14.97,23.61 v15.24,23.88
  Top 0.254: Q1.1 14.97,22.84
  Bottom 0.203: v15.24,23.88 15.24,25.65 17.27,27.69 19.18,27.69 27.05,35.56 35.18,35.56 37.59,37.97 37.59,38 J2.5
D7  (via drill 0.25)
  Top 0.203: IC2.30 v14.47,24.13 v14.48,24.13
  Bottom 0.203: v14.48,24.13 14.48,25.91 16.89,28.32 18.8,28.32 26.67,36.2 33.27,36.2 35.05,37.97 35,37.97 J2.6
D8  (via drill 0.25, 0.3)
  Top 0.203: IC2.11 16.47,13.55 v16.64,13.72 | J2.7 32.46,35 v32.38,34.92
  Bottom 0.203: v16.64,13.72 16.64,25.91 17.78,27.05 19.43,27.05 27.18,34.8 32.26,34.8 v32.38,34.92
D9  (via drill 0.25, 0.3)
  Top 0.203: IC2.12 16.97,12.36 v17.65,11.68 | J2.8 29.97,37.95 29.97,33.15 v30.23,32.89 31.37,31.75 R14.1 | U2.9 27.39,18.2 26.92,18.67 26.92,27.94 26.92,29.34 v27.18,29.59
  Bottom 0.203: v17.65,11.68 19.05,13.08 19.05,20.7 20.95,22.61 20.95,25.53 24.89,29.46 | 24.89,29.46 28.32,32.89 v30.23,32.89 | v27.18,29.59 25.02,29.59 24.89,29.46
D10  (via drill 0.25)
  Top 0.254: v15.39,19.23 15.97,19.81 IC2.27
  Bottom 0.203: J8.7 26.59,7.87 19.68,7.87 16,11.56 16,18.62 v15.39,19.23
D11  (via drill 0.25)
  Top 0.254: v15.37,17.5 15.57,17.5 16.97,18.9 IC2.25
  Bottom 0.203: J8.8 24.55,7.37 19.43,7.37 15.37,11.43 v15.37,17.5
D12  (via drill 0.25)
  Top 0.254: IC2.28 15.47,20.71 v14.73,19.96
  Bottom 0.203: J8.9 22.78,6.6 19.18,6.6 14.73,11.05 v14.73,19.96
D13  (via drill 0.25)
  Top 0.254: IC2.26 16.47,19.22 15.77,18.52 14.38,18.52 v14.1,18.8
  Bottom 0.203: J8.10 20.87,5.97 18.92,5.97 14.1,10.79 v14.1,18.8
D+  (via drill 0.25)
  Top 0.203: IC2.34 12.47,20.35 11.68,19.56 11.68,14.99 10.16,13.46 v6.73,13.46
  Top 0.406: v6.73,10.41 J5.3
  Bottom 0.203: v6.73,13.46 v6.73,10.41
D-
  Top 0.203: IC2.33 12.97,20.21 12.19,19.43 12.19,14.73 10.67,13.21 | 10.67,13.21 10.3,12.84 | J5.2 5.98,11.06 7.75,12.83 10.29,12.83 10.67,13.21
GND  (via drill 0.25, 0.3, 0.41)
  Top 0.203: IC2.5 13.47,13.58 12.83,14.22 | IC2.18 17.52,16.77 17.4,16.89 17.4,18.16 | 19.75,1.33 19.81,1.4 | CN2.9 19.72,1.36 19.75,1.33 | IC2.42 9.4,17.27 | 19.75,1.33 18.92,0.51 18.03,0.51 17.14,1.4 | IC2.42 9.4,17.27 | 9.4,17.27 v8.89,17.78
  Top 0.254: D1.2 24.13,12.95 23.75,12.57 v23.37,12.57 | U2.10 27.45,17 v27.3,17.14 | IC2.35 11.97,22.06 v11.94,22.1
  Top 0.305: IC2.42 | v8.89,17.78 8.51,18.16 6.99,18.16 6.22,17.4 C7.2 | v18.8,33.91 20.95,33.91 R13.2
  Bottom 0.203: v8.89,17.78 8.89,17.65 8.76,17.78
  other vias: 23.5,35.56 8.89,25.78 8.26,26.04 0.76,11.05 0.76,12.19 2.16,26.92 51.94,22.23 2.16,28.57 53.47,22.1 2.16,26.16 2.16,27.69 1.4,21.46 2.16,21.46 5.71,38.86 4.83,38.86 1.27,22.73 2.03,22.73 12.95,14.22 40.01,15.37 14.22,6.86 6.22,14.73 20.7,1.78 21.08,3.43 3.3,5.08 4.83,4.45 10.92,4.57 5.46,5.84 16.76,6.22 47.5,9.4 45.34,6.35 46.61,9.4 42.93,3.56 40.39,3.56 37.97,3.56 53.72,4.32 20.19,3.94 19.3,3.94 46.61,5.21 9.27,21.97 8.38,21.97 28.57,39.12 36.83,35.94 33.78,39.24 36.32,39.24 40.39,16.89 37.72,15.49 17.78,21.21 11.81,4.06 39.5,26.67 36.07,24.26 31.88,18.8 28.7,10.67 50.55,9.27 50.67,8.13 24.51,3.43 40.64,34.8 36.07,16.13 21.08,11.3 20.32,11.94 39.75,24.13 40.51,24.13 40.39,26.67 32.26,32.89 38.99,16.38 37.97,16.51 53.47,32.89 52.58,32.89 46.61,31.37 46.86,32.26 46.74,34.67 50.67,0.89 2.16,29.46 12.57,27.18 18.8,33.02 16.26,33.91 1.91,35.81 1.02,34.67 1.02,35.69 2.67,35.43 1.91,34.92 31.11,39.19 35.31,27.69 38.23,17.65 39.24,17.78 32,22.23 31.24,12.4 52.07,24.51 52.83,24.51 53.59,24.64 30.1,31.24 22.91,23.62 21.72,22.35 22.23,24.26 24.05,27.64 17.86,26.11
  pour Bottom (isolate 0.305): -1.27,-1.27 60,-1.27 60,45 -1.27,45
  pour Top (isolate 0.305): -1.27,-1.27 60,-1.27 60,45 -1.27,45
GPS_RF
  Top 0.406: U2.28 L1.1 GPS.D
GSM_RF
  Top 0.406: U2.45 41.45,31.58 R6.1 40.17,31.62 C14.2
HRXD
  Top 0.203: U2.38 48.46,24.2 49.02,24.77 49.02,30.61 J4.1
HTXD
  Top 0.203: U2.37 50.18,23 51.05,23.88 J4.2
IO27  (via drill 0.3)
  Top 0.305: U2.26 43.85,9.18 v43.81,9.14 | v49.66,14.99 R3.1
  Bottom 0.305: v43.81,9.14 43.81,14.1 44.7,14.99 v49.66,14.99
IO28
  Top 0.305: U2.30 48.51,14.6 48.77,14.86 48.77,18.03 R4.1
MISO  (via drill 0.25)
  Top 0.254: IC2.21 19.16,18.27 20.07,19.18 20.07,20.83 v20.83,21.59 | D1.6 25.39,11.67 26.29,12.57 26.29,14.61 v24.77,16.13
  Bottom 0.254: 28.19,18.67 28.07,18.54 | 28.07,18.54 28.19,18.54 | 28.07,18.54 28.11,18.5 J7.7 28.07,18.44 28.07,16.89 27.3,16.13 v24.77,16.13
  Bottom 0.305: 28.19,18.67 28.19,20.32 27.69,20.83 26.92,21.59 v20.83,21.59
MOSI  (via drill 0.3)
  Top 0.254: IC2.19 21.98,17.27 v22.35,16.89 23.38,15.86 D1.3
  Bottom 0.203: 23.75,18.54 23.75,18.52 J7.3
  Bottom 0.254: J7.3 23.73,17.38 23.24,16.89 v22.35,16.89
N$1
  Top 0.305: R4.2 STA.+
N$2
  Top 1.016: D2.C 22.73,25.56 D3.A
N$3
  Top 0.406: PWR.+ R7.2
N$7
  Top 0.305: R3.2 NET.+
N$8
  Top 0.254: U2.18 34.16,10.42 34.16,9.27 33.91,9.02 29.08,9.02 27.05,11.05 27.05,14.73 23.24,18.54 23.24,18.57 23.24,21.92 21.57,23.6 18.8,23.6 17.53,24.87 Q1.3
N$25
  Top 0.406: CHG.- R12.1
N$26
  Top 0.406: IC1.1 17.71,34.86 R12.2
N$31
  Top 0.406: IC1.5 19.87,34.86 19.81,34.8 R13.1
N$94
  Top 0.406: C13.2 R6.2 GSM.D
PA00_XIN32
  Top 0.203: IC2.1 11.09,12.74 9.14,10.79 X1.P$2 9.09,9.09 C5.1
PA01_XOUT32
  Top 0.203: IC2.2 11.97,11.21 11.49,10.72 | X1.P$1 11.49,10.72 | 11.49,10.72 11.43,10.67 C3.1
RESET  (via drill 0.25)
  Top 0.203: IC2.40 9.29,18.27 8.76,18.8 | 8,18.92 v8.76,18.92
  Top 0.305: R1.1 8,18.92 | 8.76,18.8 v8.76,18.92
  Bottom 0.203: CN2.10 21.66,2.63 J8.11 20.81,0.51 12.7,0.51 RESET.P$1 7.37,5.84 7.37,18.16
  Bottom 0.305: C19.2 6.86,17.65 7.37,18.16 7.75,18.54 8.13,18.92 v8.76,18.92
SCK  (via drill 0.25)
  Top 0.254: IC2.20 19.8,17.77 20.83,18.8 | 20.83,18.8 v20.83,20.7 | 20.83,18.8 21.97,18.8 24,16.76 24,16 25.78,14.22 25.78,12.95 25.27,12.45 24.51,12.45 24.13,12.06 D1.5
  Bottom 0.254: 25.53,20.19 25.91,19.81 25.91,18.52 J7.5
  Bottom 0.305: 25.53,20.19 25.02,20.7 v20.83,20.7
SCL  (via drill 0.25)
  Top 0.203: R9.1 12.7,22.23 13.21,22.23 13.47,21.96 IC2.32 13.47,20.08 12.95,19.56 12.95,18.16 18.54,12.57 18.54,10.41 19.43,9.53 24.38,9.53 26.67,7.24 31.75,7.24 32.13,7.24 v32.77,6.6
  Bottom 0.254: v32.77,6.6 34.16,8 36.07,8 37.47,6.6 J3.2
SDA
  Top 0.203: R11.1 13.97,22.35 IC2.31 13.97,19.82 13.46,19.3 13.46,18.29 19.05,12.7 19.05,10.67 19.68,10.03 24.64,10.03 26.92,7.75 33.66,7.75 J3.1
SIM_CLK  (via drill 0.3)
  Top 0.203: v44.45,20.45 44.45,26.54 45.72,27.81 47.24,27.81 U2.41
  Bottom 0.203: v44.45,20.45 44.36,20.36 U4.3 37.65,20.32 36.07,20.32 35.67,20.71 D5.4
SIM_DATA  (via drill 0.3)
  Top 0.203: v45.47,21.72 45.47,24.64 46.23,25.4 U2.39
  Bottom 0.203: v45.47,21.72 45.38,21.63 U4.7 37.72,21.6 37.72,21.59 37.47,21.84 35.18,21.84 34.92,21.59 D5.5
SIM_RST  (via drill 0.3)
  Top 0.203: v43.69,22.99 43.69,26.67 45.09,28.07 45.09,29.46 U2.42
  Bottom 0.203: D5.3 37.59,23 U4.2 43.6,22.9 v43.69,22.99
SIM_VDD  (via drill 0.3)
  Top 0.203: v45.59,26.54 47.24,26.54 47.25,26.55 | 47.25,26.55 47.37,26.67 47.24,26.67 | U2.40 47.25,26.55
  Bottom 0.203: v45.59,26.54 44.49,25.44 U4.1 37.65,25.4 34.8,25.4 34.17,24.78 D5.1
SWCLK  (via drill 0.25)
  Top 0.203: IC2.45 9,15.77 v8.89,15.88
  Bottom 0.203: v8.89,15.88 8.89,9.62 CN2.4
SWDIO  (via drill 0.25)
  Top 0.203: IC2.46 8.66,15.27 v8,14.61
  Bottom 0.203: v8,14.61 8,9.27 14.61,2.67 CN2.2
VBAT  (via drill 0.25)
  Top 0.305: 6.46,30.72 6.48,30.73 | J6.1 6.48,30.73 | 5.84,32.51 5.84,32.26 5.97,32.13 | 5.97,32.13 6.6,31.5 7.11,31.5 7.24,31.37 7.24,31.01 7.24,30.99 7.24,29.97 5.33,29.97 4.95,30.35 4.95,31.11 5.97,32.13 | 5.97,32.13 5.97,31.62 6.48,31.11 | 6.48,31.11 6.48,31.37 | 6.48,31.37 6.1,31.75 | 6.48,31.37 6.6,31.24 6.99,31.24 7.11,31.11 7.11,30.23 6.86,30.23 6.73,30.1 | 6.48,30.73 6.48,31.11
  Top 0.406: 16.58,32.96 v16.51,32.89
  Top 0.813: IC1.3 16.58,32.96
  Top 1.27: SW1.COM1 10.16,38.1 9.4,37.34 6.73,37.34 5.46,36.07 5.46,30.72 6.46,30.72
  Bottom 0.813: v16.51,32.89 8.65,32.89 J6.1
  Bottom 1.27: J2.11 14.89,38 14.22,37.34 11.68,37.34 SW1.COM1
VBAT_IN  (via drill 0.25)
  Top 0.508: R5.2 28.7,35.94 28.19,36.45 v22.86,36.45
  Top 0.559: v15.75,34.92 14.1,34.92
  Top 0.813: SW1.CH1A 13.08,38.86 14.1,37.85 14.1,34.92 14.1,34.54 R17.1 12.4,33.66 Q2.3
  Bottom 0.508: v22.86,36.45 21.72,36.45 20.19,34.92 v15.75,34.92
VBUS  (via drill 0.25)
  Top 0.254: 4.45,11.68 4.45,24.38 5.59,25.53 7.49,25.53 7.62,25.4 7.62,23.88 7.37,23.62 6.1,23.62 5.33,22.86 5.33,13.46 5.84,12.95 5.84,11.68 4.7,11.68 | 4.7,11.68 4.57,11.81 | 4.7,11.81 4.7,24.38 5.71,25.4 7.37,25.4 7.49,25.27 7.49,24 7.24,23.75 5.46,23.75 4.83,23.11 | 4.83,23.11 4.83,12.19 | 4.83,12.19 4.83,11.94 5.59,11.94 5.59,12.95 5.33,13.21 5.33,12.19 5.46,12.06 4.95,12.06 4.83,12.19 | 4.83,23.11 4.83,24.26 5.84,25.27 7.24,25.27 7.37,25.15 7.37,24.13 7.11,23.88 5.33,23.88 4.95,23.5 4.95,24.13 5.97,25.15 7.11,25.15 7.24,25.02 7.24,24.26 6.99,24 5.21,24 5.08,23.88 5.08,24 6.1,25.02 6.99,25.02 7.11,24.89 7.11,24.38 6.86,24.13 5.46,24.13 6.22,24.89 6.86,24.89 6.86,24.38 6.73,24.26 5.84,24.26 6.35,24.77 6.6,24.77 6.73,24.64 6.73,24.51 6.6,24.38 6.48,24.38 | 6.48,24.38 6.22,24.38 6.48,24.64 6.6,24.51 | J1.1 6.48,24.38 | 4.7,11.68 4.73,11.71 J5.1
  Top 0.406: 22.73,33.15 22.73,35.18 21.34,36.58 v20.45,36.58 19.56,37.47 CHG.+ | IC1.4 20.1,32.61 20.57,32.13 21.97,32.13 | 22.35,32.13 C9.2 23.75,32.13 22.73,33.15 | J5.1 5.08,22.97 J1.1 | 22.73,33.15 22.73,32.89 21.97,32.13 | 21.97,32.13 22.35,32.13 | 22.35,32.13 22.86,32.64 22.99,32.64 23.24,32.38 23.11,32.38 22.99,32.26
  Bottom 0.406: 15.24,35.69 14.35,34.8 | 14.35,34.8 14.22,34.67 | 14.22,34.67 13.59,34.67 | 11.3,34.67 9.53,34.67 | 15.24,35.69 19.56,35.69 v20.45,36.58 20.57,36.7 20.07,36.7 19.43,36.07 14.99,36.07 13.59,34.67 | 4.7,32.89 4.7,33.02 | 6.99,23.88 5.59,23.88 4.19,25.27 4.19,33.15 5.59,34.54 8.89,34.54 9.53,35.18 9.53,36.2 9.78,36.45 10.54,36.45 10.79,36.2 10.79,35.18 11.3,34.67 | 11.3,34.67 13.59,34.67 | 15.24,35.69 14.86,35.69 14.1,34.92 14.22,34.92 14.35,34.8 | 14.22,34.67 13.59,34.04 7.49,34.04 5.08,31.62 5.08,25.65 5.84,24.89 6.99,24.89 7.11,24.77 7.11,23.88 6.99,23.88 | 6.99,23.88 6.73,24.13 6.73,24.51 6.86,24.64 5.46,24.64 4.83,25.27 4.83,31.75 7.24,34.16 6.86,34.16 4.95,32.26 4.95,32.64 6.35,34.04 9.4,34.04 9.78,34.42 11.3,34.42 | 13.59,34.42 11.3,34.42 | 11.3,34.42 10.54,35.18 10.54,35.94 10.41,36.07 9.91,36.07 9.91,35.56 9.78,35.43 9.91,35.43 10.54,34.8
  Bottom 0.61: SW1.COM2 10.16,35.31 9.53,34.67 9.27,34.42 6.1,34.42 4.7,33.02 | J1.1 5.73,24.37 4.83,25.27 4.7,25.4 4.7,32.89
VDDCORE
  Top 0.203: IC2.43 9.39,16.77 9.02,17.14 C7.1
VIN  (3 unrouted)
  Top 0.254: U2.11 27.13,15.8 25.4,17.53 C16.A | C8.2 25.27,28.09 | 23.24,30.35 22.35,31.24
  Top 0.305: C8.2 C12.2 25.27,20.7 C16.A | U2.12 31.75,14.6 33.91,12.45 45.09,12.45 46.86,10.67 L1.2 | 24.28,28.7 24.31,28.73 24.31,28.85 | 9.7,29.9 9.69,29.91 U5.8
  Top 0.406: U2.11 U2.12 | U5.8 9.67,29.98 9.67,31.24 | 9.67,31.24 Q2.2 | 22.35,31.24 13.21,31.24 | 13.21,31.24 11.94,31.24 | 11.94,31.24 9.67,31.24 | R17.2 13.21,31.24 | C10.2 13.21,29.84 13.21,31.24 | U5.5 11.94,30.25 11.94,31.24 | 29.08,15.75 29.06,15.77 29.06,16 27.25,16 25.91,17.35 25.91,29.92 24.94,30.89 22.81,30.89 22.35,31.34 16.76,31.34 15.67,32.44 12.98,32.44 12.22,31.67 11.02,31.67 10.36,32.33 9.37,32.33 9.22,32.18 9.22,30.18 9.58,29.82 9.7,29.82 9.7,29.9 9.45,30.15 9.45,31.52 9.53,31.6 13.06,31.6 12.78,31.88 10.31,31.88 10.19,32 10.19,31.83 9.5,31.14 9.5,30.4 9.53,30.38 9.53,30.48 10.13,31.09 11.4,31.09 11.58,30.91 11.58,29.82 12.7,29.82 13.18,29.34 13.56,29.34 | 13.72,29.34 13.56,29.34 | 13.56,29.34 12.85,30.05 12.14,30.05 12.12,30.07 12.12,30.86 12.22,30.96 12.9,30.96 12.93,30.94 12.93,30.4 12.95,30.38 12.45,30.38 12.42,30.35 12.42,30.61 12.7,30.89 12.7,30.63 13.03,30.63 13.69,29.97 14.76,31.04 21.74,31.04 22.1,30.68 22.1,29.01 22.4,28.7 24.28,28.7 25.09,27.89 25.09,17.65 28.04,14.71 29.44,14.71 | 31.5,14.71 29.44,14.71 | 29.44,14.71 29.13,14.4 29.13,16 30.33,16 31.67,14.66 | 22.2,29.18 23.98,29.18 24.31,28.85 22.66,28.85 22.53,28.98 | 25.35,28.32 22.61,31.06 22.17,31.06 22.55,30.68 24.69,30.68 25.58,29.79 25.63,29.79 25.63,17.45 27.61,15.47 29.95,15.47 30.38,15.04 30.73,15.04 30.71,15.06 28.25,15.06 27.58,15.72 27.43,15.72 27.48,15.77 30.1,15.77 31.14,14.73 31.47,14.73 31.5,14.71 | 25.35,28.32 25.35,24.61 | 25.35,28.32 25.35,29.57 24.51,30.4 24.51,29.44 25.09,28.85 25.09,29.36 24.66,29.79 | 31.6,14.71 31.5,14.71 | C17.2 15.57,32.13 16.28,31.42 14.73,31.42 13.61,30.3 13.61,30.71 13.92,31.01 13.56,31.01 13.44,30.89 13.44,31.62 13.69,31.88 15.54,31.88 15.77,31.65 13.72,31.65 13.54,31.47
VIO  (via drill 0.3)
  Top 0.305: R14.2 34.8,31.75 v34.92,31.62 | v43.81,27.94 43.81,29.47 U2.43
  Bottom 0.305: v34.92,31.62 42.8,31.62 43.81,30.61 v43.81,27.94
VSYS  (via drill 0.25)
  Top 0.305: 13.08,36.45 13.13,36.45
  Top 0.406: 3.68,17.02 3.68,25.02 | 3.68,25.02 3.68,25.27 5.08,26.67 6.99,26.67 8.26,27.94 v8.26,29.34 | v8.26,29.34 8.26,32.56 Q2.1 10.86,33.97 10.92,34.04 | R15.1 15.49,29.72 | SW1.CH2A 10.92,34.04 | 10.92,34.04 9.65,34.04 8.26,32.64 v8.26,29.34 | R10.2 3.05,16.38 3.68,17.02 | 19.79,29.59 D2.A | 2.41,16.66 3.02,16.66 3.58,17.22 3.58,18.75 3.25,19.07 3.25,25.53 4.93,27.2 6.91,27.2 7.98,28.27 7.98,33.25 8.97,34.24 10.52,34.24 11.76,35.48 11.76,36.09 12.29,36.63 13.01,36.63 13.13,36.5 13.13,36.45 13.13,36.22 10.57,33.66 9.5,33.66 8.41,32.56 8.41,27.94 6.99,26.52 5.18,26.52 3.68,25.02 | 3.68,25.02 3.48,25.02 | 3.48,25.02 3.48,19.07 | 3.48,25.02 3.48,25.43 4.98,26.92 6.96,26.92 8.08,28.04 8.08,32.89 9.17,33.98 10.59,33.98 12.93,36.32 12.55,36.32 12.47,36.4 12.47,36.27 11.91,35.71 11.91,35.74 | 11.58,34.9 12.5,34.9 13.13,35.53 13.13,36.4 13.08,36.45 13.08,35.87 12.34,35.13 | 2.46,16.64 2.41,16.59 2.41,16.05 2.46,16 3.25,16 3.68,16.43 3.68,16.71 | 3.68,17.02 3.68,16.71 | 3.68,16.71 3.2,16.23
  Top 0.61: 15.49,29.72 v14.73,29.72
  Top 1.016: R15.1 19.79,29.59
  Bottom 1.016: v14.73,29.72 14.35,29.34 v8.26,29.34

### Text on the board
tPlace: VBAT | GND | 3V3 | D9 | D8 | D7 | D6 | D5 | D4 | D3 | D2 | OFF | ON | VBAT | + | HRX | HTX | GND | - | + | - | CHG | SDA | SCL | 3V3 | GND | SWD | RST | D13 | D12 | D11 | D10 | A0 | A1 | A2 | A3 | A4 | A5
bNames: Maduino Zero | A9G GPS Tracker v3.3 | www.makerfabs.com | A9 | A9G